# Altium project Sensors_IO_Board.PrjPcb
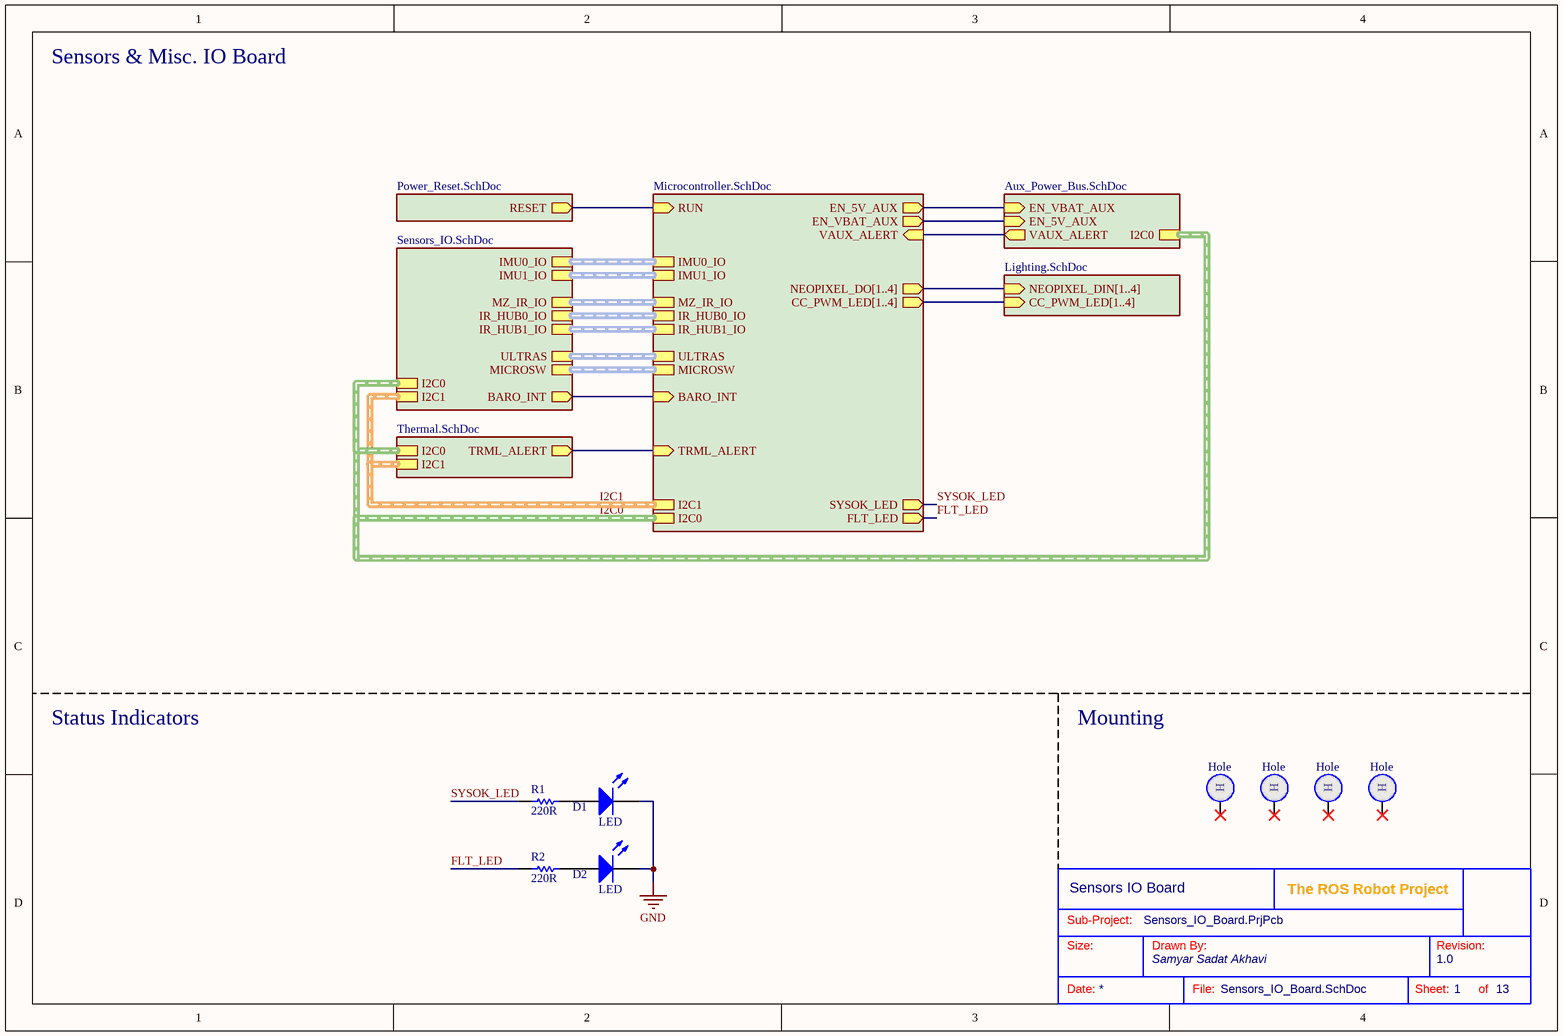
[diagram p0: Sensors_IO_Board.SchDoc]
MainProjectName: The ROS Robot Project
7 sheets, 136 parts. Net scope: hierarchical (ports join the sheet entries above them; power ports are global).
Board file: Sensors_IO_Board.PcbDoc
Sheets:
  Sensors_IO_Board.SchDoc
    MCU = Microcontroller.SchDoc
    THERM_CTRL = Thermal.SchDoc
      FAN1 = Fan_Drive.SchDoc
      FAN2 = Fan_Drive.SchDoc
      FAN3 = Fan_Drive.SchDoc
    LIGHTING = Lighting.SchDoc
      NEO_LED1 = Neopixel_Interface.SchDoc
      NEO_LED2 = Neopixel_Interface.SchDoc
      NEO_LED3 = Neopixel_Interface.SchDoc
      NEO_LED4 = Neopixel_Interface.SchDoc
  Ultrasonic_Interface.SchDoc

## Sheet Sensors_IO_Board.SchDoc: Sensors IO Board
size A4; DrawnBy: Samyar Sadat Akhavi; Revision: 1.0; SheetNumber: 1; SheetTotal: 13

### Parts
(Parts that share a designator on the sheet are numbered #1, #2 ... from top to bottom, then left to right.)
?#1  (no value)  (graphical)
D1  LED  [LED_1206]
D2  LED  [LED_1206]
Hole1  Hole  [hole_2.6]  (no BOM)
Hole2  Hole  [hole_2.6]  (no BOM)
Hole3  Hole  [hole_2.6]  (no BOM)
Hole4  Hole  [hole_2.6]  (no BOM)
R1  220R  [RES_0603]
R2  220R  [RES_0603]

### Sub-sheets
AUX_PWR = Aux_Power_Bus.SchDoc (file not in this document): I2C0 (harness I2C), EN_5V_AUX (in), VAUX_ALERT (out), EN_VBAT_AUX (in)
LIGHTING = Lighting.SchDoc: NEOPIXEL_DIN[1..4] (in), CC_PWM_LED[1..4] (in)
MCU = Microcontroller.SchDoc: RUN (in), I2C1 (harness I2C), I2C0 (harness I2C), EN_5V_AUX (out), EN_VBAT_AUX (out), VAUX_ALERT (in), BARO_INT (in), IR_HUB0_IO (harness ToF_Hub_IO), IR_HUB1_IO (harness ToF_Hub_IO), IMU0_IO (harness IMU_IO), IMU1_IO (harness IMU_IO), MICROSW (harness Microswitches), MZ_IR_IO (harness ToF_IO), ULTRAS (harness Ultrasonics), TRML_ALERT (in), NEOPIXEL_DO[1..4] (out), CC_PWM_LED[1..4] (out), FLT_LED (out), SYSOK_LED (out)
PWR = Power_Reset.SchDoc (file not in this document): RESET (out)
SENS_IO = Sensors_IO.SchDoc (file not in this document): BARO_INT (out), I2C0 (harness I2C), I2C1 (harness I2C), IMU0_IO (harness IMU_IO), IMU1_IO (harness IMU_IO), IR_HUB0_IO (harness ToF_Hub_IO), IR_HUB1_IO (harness ToF_Hub_IO), MICROSW (harness Microswitches), MZ_IR_IO (harness ToF_IO), ULTRAS (harness Ultrasonics)
THERM_CTRL = Thermal.SchDoc: I2C0 (harness I2C), I2C1 (harness I2C), TRML_ALERT (out)

### Nets
GND: D1.2(K) D2.2(K)
FLT_LED: R2.2 ; sheet MCU/FLT_LED
SYSOK_LED: R1.2 ; sheet MCU/SYSOK_LED
TRML_ALERT: sheet MCU/TRML_ALERT, sheet THERM_CTRL/TRML_ALERT
NetD1_1: D1.1(A) R1.1
NetD2_1: D2.1(A) R2.1
NetIC1_1: sheet MCU/EN_5V_AUX, sheet AUX_PWR/EN_VBAT_AUX
NetIC1_2: sheet MCU/EN_VBAT_AUX, sheet AUX_PWR/EN_5V_AUX
NetIC1_35: sheet MCU/RUN, sheet PWR/RESET
NetIC1_43: sheet MCU/BARO_INT, sheet SENS_IO/BARO_INT
NetIC1_57: sheet MCU/VAUX_ALERT, sheet AUX_PWR/VAUX_ALERT

Not connected (* = marked no-connect by the designer): Hole1 1*; Hole2 1*; Hole3 1*; Hole4 1*

### Buses and harness runs
bus sheet LIGHTING/CC_PWM_LED[1..4] = sheet MCU/CC_PWM_LED[1..4]
bus sheet LIGHTING/NEOPIXEL_DIN[1..4] = sheet MCU/NEOPIXEL_DO[1..4]
harness I2C0 = sheet AUX_PWR/I2C0 = sheet MCU/I2C0 = sheet SENS_IO/I2C0 = sheet THERM_CTRL/I2C0
harness I2C1 = sheet MCU/I2C1 = sheet SENS_IO/I2C1 = sheet THERM_CTRL/I2C1
harness sheet MCU/IMU0_IO = sheet SENS_IO/IMU0_IO
harness sheet MCU/IMU1_IO = sheet SENS_IO/IMU1_IO
harness sheet MCU/IR_HUB0_IO = sheet SENS_IO/IR_HUB0_IO
harness sheet MCU/IR_HUB1_IO = sheet SENS_IO/IR_HUB1_IO
harness sheet MCU/MICROSW = sheet SENS_IO/MICROSW
harness sheet MCU/MZ_IR_IO = sheet SENS_IO/MZ_IR_IO
harness sheet MCU/ULTRAS = sheet SENS_IO/ULTRAS

### Notes on the sheet
- Sensors & Misc. IO Board
- Status Indicators
- Mounting
- Sub-Project:
- Size:
- Drawn By:
- Revision:
- Date:
- File:
- Sheet:
- of
- (in symbol Hole) H

### Library data of the parts
?#1 = Standard Title Block
D1 = LED: Indicator LED; Color: Green
D2 = LED: Indicator LED; Color: Amber
R1 R2 = Resistor: Power: 1/8W; Value: 220R

## Sheet Microcontroller.SchDoc: Micrcontroller (RP2350B)
size B; DrawnBy: Samyar Sadat Akhavi; Revision: 1.0; SheetNumber: 3; SheetTotal: 13
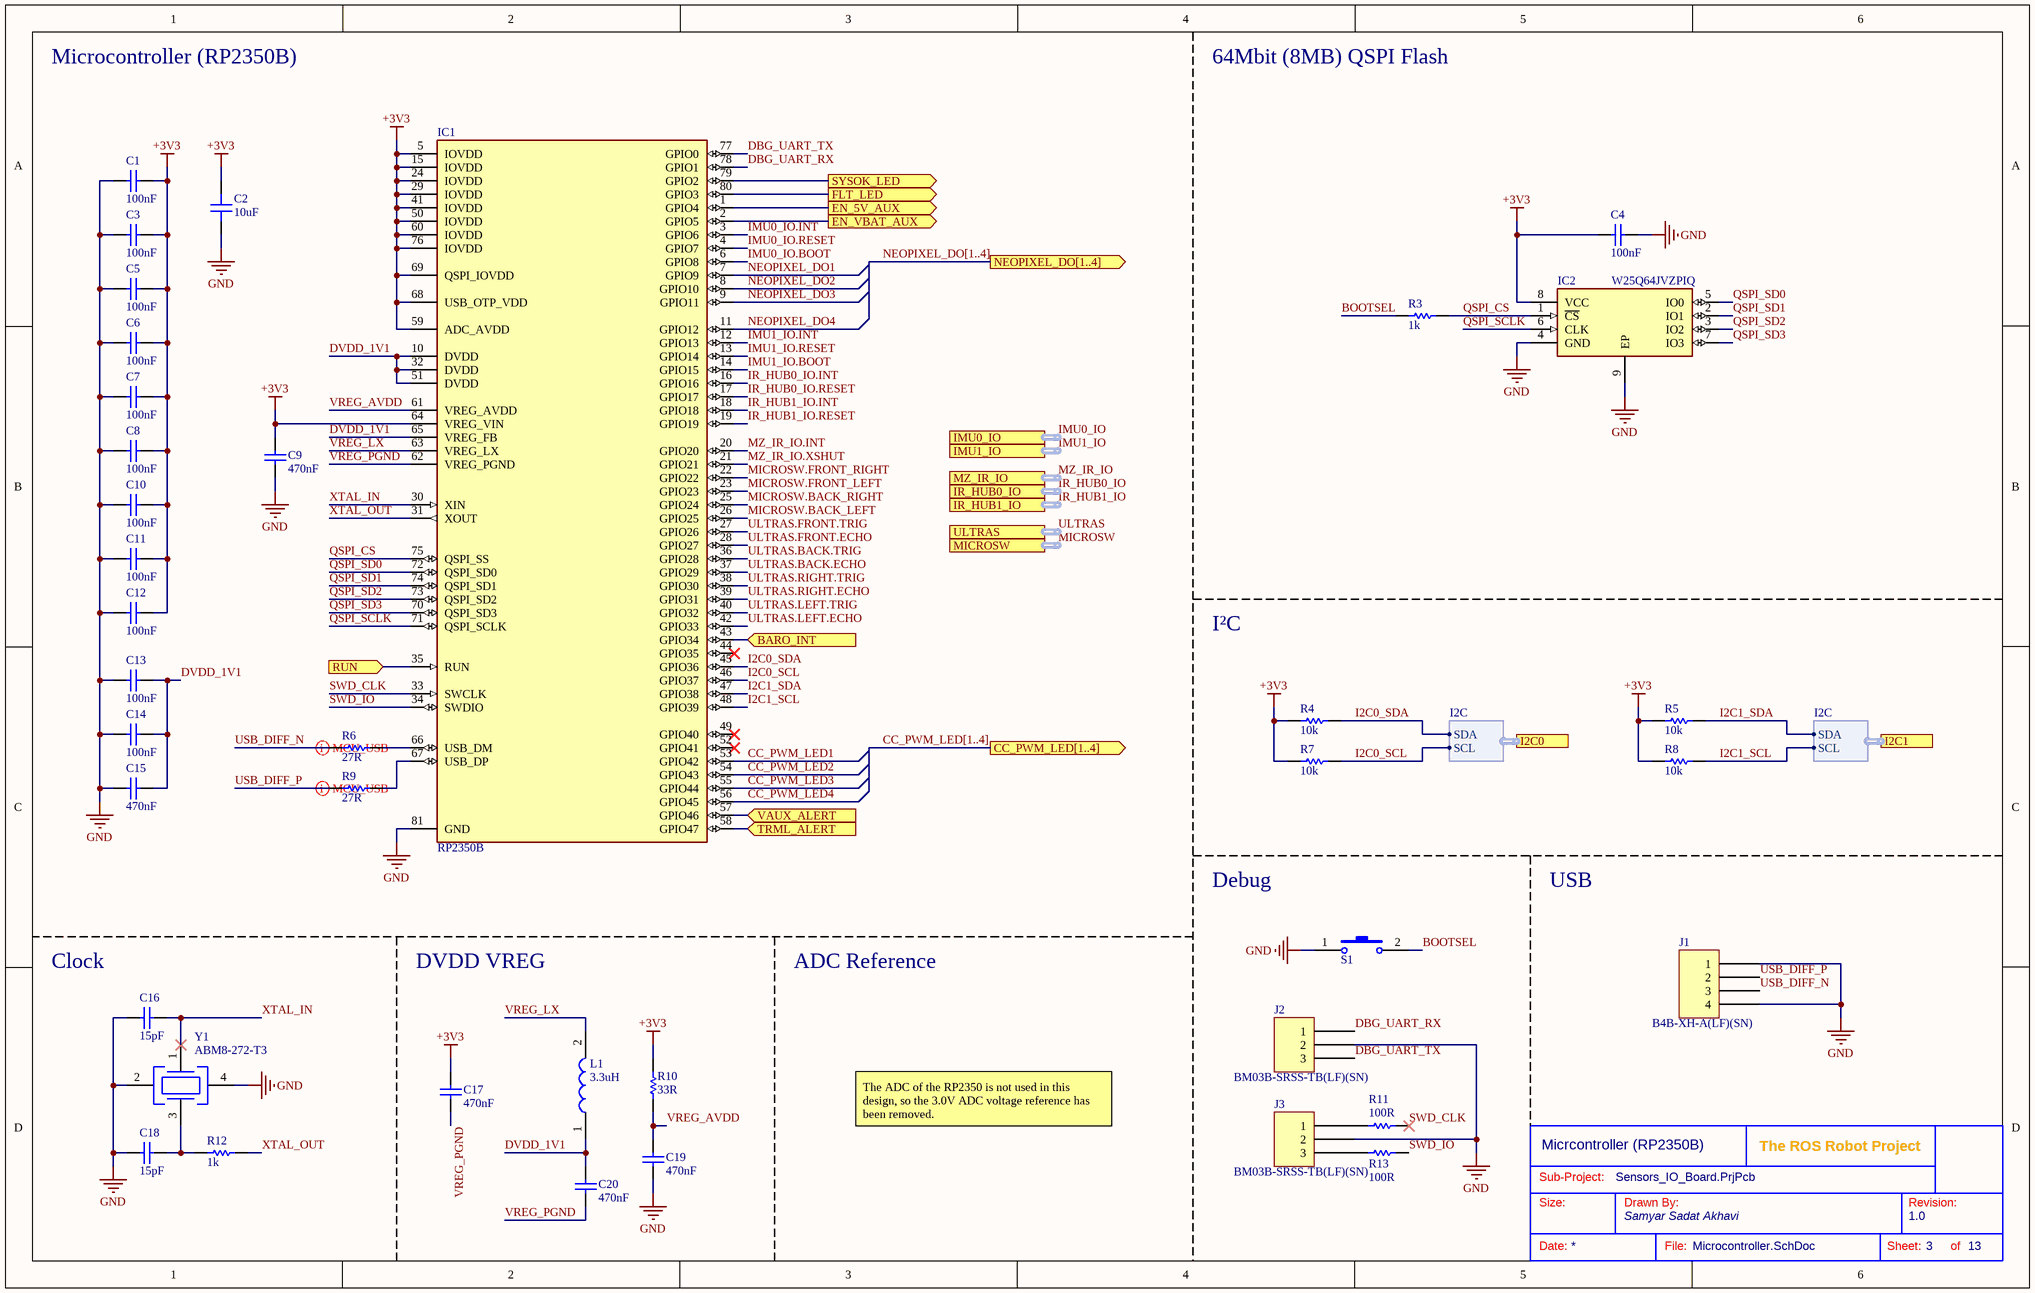
[diagram p1: Microcontroller.SchDoc]

### Parts
(Parts that share a designator on the sheet are numbered #1, #2 ... from top to bottom, then left to right.)
?#2  (no value)  (graphical)
C1  100nF  [CAP 0402_1005]
C2  10uF  [CAP 0805_2012]
C3  100nF  [CAP 0402_1005]
C4  100nF  [CAP_SMD_603]
C5  100nF  [CAP 0402_1005]
C6  100nF  [CAP 0402_1005]
C7  100nF  [CAP 0402_1005]
C8  100nF  [CAP 0402_1005]
C9  470nF  [CAP 0402_1005]
C10  100nF  [CAP 0402_1005]
C11  100nF  [CAP 0402_1005]
C12  100nF  [CAP 0402_1005]
C13  100nF  [CAP 0402_1005]
C14  100nF  [CAP 0402_1005]
C15  470nF  [CAP 0402_1005]
C16  15pF  [CAP 0402_1005]
C17  470nF  [CAP 0402_1005]
C18  15pF  [CAP 0402_1005]
C19  470nF  [CAP 0402_1005]
C20  470nF  [CAP 0402_1005]
IC1  RP2350B  [QFN40P1000X1000X90-81N-D]
IC2  W25Q64JVZPIQ  [SON127P600X500X80-9N-D]
J1  B4B-XH-A(LF)(SN)  [JST XH B4B-XH-A]
J2  BM03B-SRSS-TB(LF)(SN)  [JST BM03B-SRSS-TB]
J3  BM03B-SRSS-TB(LF)(SN)  [JST BM03B-SRSS-TB]
L1  3.3uH  [AOTAB201610S3R3101T]
R3  1k  [RES_0603]
R4  10k  [RES_0603]
R5  10k  [RES_0603]
R6  27R  [RES_0603]
R7  10k  [RES_0603]
R8  10k  [RES_0603]
R9  27R  [RES_0603]
R10  33R  [RES 0402_1005]
R11  100R  [RES_0603]
R12  1k  [RES 0402_1005]
R13  100R  [RES_0603]
S1  PTS815_SJK_250_SMTR_LFS  [PTS815SJK250SMTRLFS]  (value not drawn)
Y1  ABM8-272-T3  [ABM8272T3]

### Ports
BARO_INT (in, see Sensors_IO_Board[2B], Sensors_IO[1D]), CC_PWM_LED[1..4] (out, see Sensors_IO_Board[3B], Lighting[2A]), EN_5V_AUX (out, see Sensors_IO_Board[3A]), EN_VBAT_AUX (out, see Sensors_IO_Board[3A]), FLT_LED (out, see Sensors_IO_Board[3C]), I2C0 (harness I2C, see Sensors_IO_Board[2C], Aux_Power_Bus[4C], Sensors_IO[3C], Thermal[4C]), I2C1 (harness I2C, see Sensors_IO_Board[2B], Sensors_IO[3C], Thermal[4C]), IMU0_IO (harness IMU_IO, see Sensors_IO_Board[2B], Sensors_IO[4C]), IMU1_IO (harness IMU_IO, see Sensors_IO_Board[2B], Sensors_IO[3C]), IR_HUB0_IO (harness TOF_HUB_IO, see Sensors_IO_Board[2B], Sensors_IO[4B]), IR_HUB1_IO (harness ToF_Hub_IO, see Sensors_IO_Board[2B], Sensors_IO[3B]), MICROSW (harness Microswitches, see Sensors_IO_Board[2B], Sensors_IO[3C]), MZ_IR_IO (harness ToF_IO, see Sensors_IO_Board[2B], Sensors_IO[3C]), NEOPIXEL_DO[1..4] (out, see Sensors_IO_Board[3B]), RUN (in, see Sensors_IO_Board[2A]), SYSOK_LED (out, see Sensors_IO_Board[3B]), TRML_ALERT (in, see Sensors_IO_Board[2B], Thermal[4C]), ULTRAS (harness Ultrasonics, see Sensors_IO_Board[2B], Sensors_IO[3D]), VAUX_ALERT (in, see Sensors_IO_Board[3A], Aux_Power_Bus[4C])

### Harnesses
I2C: SDA, SCL

### Nets
+3V3: C1.1 C2.1 C3.1 C4.2 C5.1 C6.1 C7.1 C8.1 C9.2 C10.1 C11.1 C12.1 C17.1 IC1.5(IOVDD) IC1.15(IOVDD) IC1.24(IOVDD) IC1.29(IOVDD) IC1.41(IOVDD) IC1.50(IOVDD) IC1.59(ADC_AVDD) IC1.60(IOVDD) IC1.64(VREG_VIN) IC1.68(USB_OTP_VDD) IC1.69(QSPI_IOVDD) IC1.76(IOVDD) IC2.8(VCC) R4.2 R5.2 R7.2 R8.2 R10.1
GND: C1.2 C2.2 C3.2 C4.1 C5.2 C6.2 C7.2 C8.2 C9.1 C10.2 C11.2 C12.2 C13.1 C14.1 C15.1 C16.1 C18.1 C19.2 IC1.81(GND) IC2.4(GND) IC2.9(EP) J1.1 J1.4 J2.2 J3.2 S1.1(COM) Y1.2(GND_1) Y1.4(GND_2)
BOOTSEL: R3.2 S1.2(NO)
CC_PWM_LED1: IC1.53(GPIO42)
CC_PWM_LED2: IC1.54(GPIO43)
CC_PWM_LED3: IC1.55(GPIO44)
CC_PWM_LED4: IC1.56(GPIO45)
DBG_UART_RX: IC1.78(GPIO1) J2.1
DBG_UART_TX: IC1.77(GPIO0) J2.3
DVDD_1V1: C13.2 C14.2 C15.2 C20.1 IC1.10(DVDD) IC1.32(DVDD) IC1.51(DVDD) IC1.65(VREG_FB) L1.1
FLT_LED: IC1.80(GPIO3) ; port FLT_LED
I2C0_SCL: IC1.46(GPIO37) R7.1 ; port I2C0.SCL  [project net I2C0.SCL]
I2C0_SDA: IC1.45(GPIO36) R4.1 ; port I2C0.SDA  [project net I2C0.SDA]
I2C1_SCL: IC1.48(GPIO39) R8.1 ; port I2C1.SCL  [project net I2C1.SCL]
I2C1_SDA: IC1.47(GPIO38) R5.1 ; port I2C1.SDA  [project net I2C1.SDA]
IMU0_IO.BOOT: IC1.6(GPIO8)
IMU0_IO.INT: IC1.3(GPIO6)
IMU0_IO.RESET: IC1.4(GPIO7)
IMU1_IO.BOOT: IC1.14(GPIO15)
IMU1_IO.INT: IC1.12(GPIO13)
IMU1_IO.RESET: IC1.13(GPIO14)
IR_HUB0_IO.INT: IC1.16(GPIO16)
IR_HUB0_IO.RESET: IC1.17(GPIO17)
IR_HUB1_IO.INT: IC1.18(GPIO18)
IR_HUB1_IO.RESET: IC1.19(GPIO19)
MICROSW.BACK_LEFT: IC1.26(GPIO25)
MICROSW.BACK_RIGHT: IC1.25(GPIO24)
MICROSW.FRONT_LEFT: IC1.23(GPIO23)
MICROSW.FRONT_RIGHT: IC1.22(GPIO22)
MZ_IR_IO.INT: IC1.20(GPIO20)
MZ_IR_IO.XSHUT: IC1.21(GPIO21)
NEOPIXEL_DO1: IC1.7(GPIO9)  [project net NEOPIXEL_DIN1]
NEOPIXEL_DO2: IC1.8(GPIO10)  [project net NEOPIXEL_DIN2]
NEOPIXEL_DO3: IC1.9(GPIO11)  [project net NEOPIXEL_DIN3]
NEOPIXEL_DO4: IC1.11(GPIO12)  [project net NEOPIXEL_DIN4]
QSPI_CS: IC1.75(QSPI_SS) IC2.1(~{CS}) R3.1
QSPI_SCLK: IC1.71(QSPI_SCLK) IC2.6(CLK)
QSPI_SD0: IC1.72(QSPI_SD0) IC2.5(IO0)
QSPI_SD1: IC1.74(QSPI_SD1) IC2.2(IO1)
QSPI_SD2: IC1.73(QSPI_SD2) IC2.3(IO2)
QSPI_SD3: IC1.70(QSPI_SD3) IC2.7(IO3)
SWD_CLK: IC1.33(SWCLK) R11.1
SWD_IO: IC1.34(SWDIO) R13.1
SYSOK_LED: IC1.79(GPIO2) ; port SYSOK_LED
TRML_ALERT: IC1.58(GPIO47) ; port TRML_ALERT
ULTRAS.BACK.ECHO: IC1.37(GPIO29)
ULTRAS.BACK.TRIG: IC1.36(GPIO28)
ULTRAS.FRONT.ECHO: IC1.28(GPIO27)
ULTRAS.FRONT.TRIG: IC1.27(GPIO26)
ULTRAS.LEFT.ECHO: IC1.42(GPIO33)
ULTRAS.LEFT.TRIG: IC1.40(GPIO32)
ULTRAS.RIGHT.ECHO: IC1.39(GPIO31)
ULTRAS.RIGHT.TRIG: IC1.38(GPIO30)
USB_DIFF_N: J1.3 R6.1
USB_DIFF_P: J1.2 R9.1
VREG_AVDD: C19.1 IC1.61(VREG_AVDD) R10.2
VREG_LX: IC1.63(VREG_LX) L1.2
VREG_PGND: C17.2 C20.2 IC1.62(VREG_PGND)
XTAL_IN: C16.2 IC1.30(XIN) Y1.1(CRYSTAL_1)
XTAL_OUT: IC1.31(XOUT) R12.2
NetC18_2: C18.2 R12.1 Y1.3(CRYSTAL_2)
NetIC1_1: IC1.1(GPIO4) ; port EN_5V_AUX
NetIC1_2: IC1.2(GPIO5) ; port EN_VBAT_AUX
NetIC1_35: IC1.35(RUN) ; port RUN
NetIC1_43: IC1.43(GPIO34) ; port BARO_INT
NetIC1_57: IC1.57(GPIO46) ; port VAUX_ALERT
NetIC1_66: IC1.66(USB_DM) R6.2
NetIC1_67: IC1.67(USB_DP) R9.2
NetJ3_1: J3.1 R11.2
NetJ3_3: J3.3 R13.2

Not connected (* = marked no-connect by the designer): IC1 44(GPIO35)* 49(GPIO40)* 52(GPIO41)*

### Buses and harness runs
bus CC_PWM_LED[1..4] = port CC_PWM_LED[1..4]
bus NEOPIXEL_DO[1..4] = port NEOPIXEL_DO[1..4]
harness IMU0_IO = port IMU0_IO
harness IMU1_IO = port IMU1_IO
harness IR_HUB0_IO = port IR_HUB0_IO
harness IR_HUB1_IO = port IR_HUB1_IO
harness MICROSW = port MICROSW
harness MZ_IR_IO = port MZ_IR_IO
harness ULTRAS = port ULTRAS

### Layout directives
differential pair: USB_DIFF_N, USB_DIFF_P

### Notes on the sheet
- Microcontroller (RP2350B)
- 64Mbit (8MB) QSPI Flash
- I²C
- Debug
- USB
- Clock
- DVDD VREG
- ADC Reference
- The ADC of the RP2350 is not used in this design, so the 3.0V ADC voltage reference has been removed.
- Sub-Project:
- Size:
- Drawn By:
- Revision:
- Date:
- File:
- Sheet:
- of

### Library data of the parts
?#2 = Standard Title Block
C1 C3-C20 = Non-polar Capacitor: Generic Ceramic Capacitor; Voltage: 6.3V
  C1 C3-C8 C10-C14: Value: 100nF
  C9 C15 C17 C19 C20: Value: 470nF
  C16 C18: Value: 15pF
C2 = CL21A106KOQNNNE: CAP CER 10UF 16V X5R 0805; manufacturer: Samsung Electro-Mechanics; Capacitance: 10 µF; Tolerance: ±10%; Part Number: CL21A106KOQNNNE; Applications: General Purpose; componentlink1description: Datasheet; componentlink1url: http://www.samsungsem.com/kr/support/product-search/mlcc/CL21A106KOQNNNE.jsp; componentlink2description: DigiKey Link; componentlink2url: https://www.digikey.com/en/products/detail/samsung-electro-mechanics/CL21A106KOQNNNE/3886754; Device Package: 0805 (2012 Metric); lastupdated: 2/9/2024 8:15:37 PM; Lifecycle Status: Active; Minimum Order: 1; Mounting Type: Surface Mount, MLCC; Operating Temperature: -55°C ~ 85°C; Package / Case: 0805 (2012 Metric); packaging: TapeAndReel; partid: 14297; Part Status: Active; price: 0.01; series: CL; Size / Dimension: 0.079" L x 0.049" W (2.00mm x 1.25mm); Supplier 1: DigiKey; Supplier Part Number 1: 1276-1096-1-ND; Temperature Coefficient: X5R; Thickness (Max): 0.055" (1.40mm); value: 10uF; Voltage - Rated: 16V
IC1 = RP2350B: Integrated Circuit; Manufacturer_Name: RASPBERRY-PI; Datasheet Link: https://datasheets.raspberrypi.com/rp2350/rp2350-product-brief.pdf; Height: 0.9mm; Manufacturer_Part_Number: RP2350B
IC2 = W25Q64JVZPIQ: Integrated Circuit; Manufacturer_Name: Winbond; Datasheet Link: https://www.winbond.com/hq/search-resource-file.jsp?partNo=W25Q64JVZPIQ&type=datasheet; Height: 0.8mm; Manufacturer_Part_Number: W25Q64JVZPIQ; Mouser Part Number: 454-W25Q64JVZPIQ; Mouser Price/Stock: https://www.mouser.co.uk/ProductDetail/Winbond/W25Q64JVZPIQ?qs=qSfuJ%252Bfl%2Fd7Nj8XAKQ%2FzKA%3D%3D; Arrow Part Number: W25Q64JVZPIQ; Arrow Price/Stock: https://www.arrow.com/en/products/w25q64jvzpiq/winbond-electronics?utm_currency=USD&region=nac
J1 = B4B-XH-A(LF)(SN): CONN HEADER VERT 4POS 2.5MM; Manufacturer: JST Sales America Inc.; Contact Length - Post: 0.134" (3.40mm); Current Rating (Amps): 3A; Material Flammability Rating: UL94 V-0; Number of Positions: 4; Number of Positions Loaded: All; Pitch - Mating: 0.098" (2.50mm); Shrouding: Shrouded - 4 Wall; Style: Board to Cable/Wire; Voltage Rating: 250V; System: Connector; Part Number: B4B-XH-A(LF)(SN); ComponentLink1Description: Datasheet; ComponentLink1URL: http://www.jst-mfg.com/product/pdf/eng/eXH.pdf; ComponentLink2Description: DigiKey Link; ComponentLink2URL: http://digikey.com/product-detail/en/jst-sales-america-inc/B4B-XH-A-LF-SN/455-2249-ND/1651047; Connector Type: Header; Contact Finish - Mating: Tin; Contact Finish - Post: Tin; Contact Material: Brass; Contact Shape: Square; Contact Type: Male Pin; Fastening Type: Detent Lock; Insulation Color: Natural; Insulation Height: 0.276" (7.00mm); Insulation Material: Polyamide (PA66), Nylon 6/6; LastUpdated: 1/12/2020 11:46:34 PM; Lifecycle Status: Active; Minimum Order: 1; Mounting Type: Through Hole; Number of Rows: 1; Operating Temperature: -25°C ~ 85°C; Packaging: Bulk; PartId: 69; Part Status: Active; Price: 0.21; Series: XH; Supplier 1: DigiKey; Supplier Part Number 1: 455-2249-ND; Termination: Press-Fit, Solder
J2 J3 = BM03B-SRSS-TB(LF)(SN): CONN HEADER SMD 3POS 1MM; Manufacturer: JST Sales America Inc.; Current Rating (Amps): 0.7A; Material Flammability Rating: UL94 V-0; Number of Positions: 3; Number of Positions Loaded: All; Pitch - Mating: 0.039" (1.00mm); Shrouding: Shrouded - 4 Wall; Style: Board to Cable/Wire; Voltage Rating: 50V; Part Number: BM03B-SRSS-TB(LF)(SN); ComponentLink1Description: Datasheet; ComponentLink1URL: http://www.jst-mfg.com/product/pdf/eng/eSR.pdf; ComponentLink2Description: DigiKey Link; ComponentLink2URL: http://digikey.com/product-detail/en/jst-sales-america-inc/BM03B-SRSS-TB-LF-SN/455-1789-1-ND/926860; Connector Type: Header; Contact Finish - Mating: Tin; Contact Finish - Post: Tin; Contact Material: Copper Alloy; Contact Shape: Square; Contact Type: Male Pin; Fastening Type: Push-Pull; Features: Solder Retention; Insulation Color: Natural; Insulation Height: 0.167" (4.25mm); Insulation Material: Polyamide (PA), Nylon; LastUpdated: 1/12/2020 10:12:14 PM; Lifecycle Status: Active; Minimum Order: 1; Mounting Type: Surface Mount; Number of Rows: 1; Operating Temperature: -25°C ~ 85°C; Packaging: TapeAndReel; PartId: 14; Part Status: Active; Price: 0.24; Series: SR; Supplier 1: DigiKey; Supplier Part Number 1: 455-1789-1-ND; Termination: Solder
L1 = AOTA-B201610S3R3-101-T: Inductor; Manufacturer_Name: ABRACON; Datasheet Link: https://abracon.com/datasheets/AOTA-B201610S3R3-101-T.pdf; Height: 1mm; Manufacturer_Part_Number: AOTA-B201610S3R3-101-T; Mouser Part Number: 815-AB201610S3R3101T; Mouser Price/Stock: https://www.mouser.co.uk/ProductDetail/ABRACON/AOTA-B201610S3R3-101-T?qs=%252BXxaIXUDbq0IZvJW%2F2mv4w%3D%3D; Arrow Part Number: AOTA-B201610S3R3-101-T; Arrow Price/Stock: https://www.arrow.com/en/products/aota-b201610s3r3-101-t/abracon?utm_currency=USD&region=nac
R3-R5 R7 R8 R11 R13 = Resistor: Power: 1/8W
  R3: Value: 1k
  R4 R5 R7 R8: Value: 10k
  R11 R13: Value: 100R
R6 R9 R10 R12 = Resistor: Generic Resistor; Power: 1/8W
  R6 R9: Value: 27R
  R10: Value: 33R
  R12: Value: 1k
S1 = PTS815_SJK_250_SMTR_LFS: Switch; Manufacturer_Name: C & K COMPONENTS; Manufacturer_Part_Number: PTS815 SJK 250 SMTR LFS; Datasheet Link: https://www.mouser.com/datasheet/2/60/pts815-1535658.pdf; Height: 2mm; Mouser Part Number: 611-PTS815SJK250SMTR; Mouser Price/Stock: https://www.mouser.co.uk/ProductDetail/CK/PTS815-SJK-250-SMTR-LFS?qs=ahcBuItHZ3yETpGYMHf%2FgQ%3D%3D; Arrow Part Number: PTS815 SJK 250 SMTR LFS; Arrow Price/Stock: https://www.arrow.com/en/products/pts815-sjk-250-smtr-lfs/ck
Y1 = ABM8-272-T3: Crystal or Oscillator; Manufacturer_Name: ABRACON; Datasheet Link: https://abracon.com/datasheets/ABM8-272-T3.pdf; Height: 0.8mm; Manufacturer_Part_Number: ABM8-272-T3; Mouser Part Number: 815-ABM8-272-T3; Mouser Price/Stock: https://www.mouser.co.uk/ProductDetail/ABRACON/ABM8-272-T3?qs=QpmGXVUTftEj6miOiJBMxQ%3D%3D

## Sheet Thermal.SchDoc: Thermal Management
size A4; DrawnBy: Samyar Sadat Akhavi; Revision: 1.0; SheetNumber: 8; SheetTotal: 13
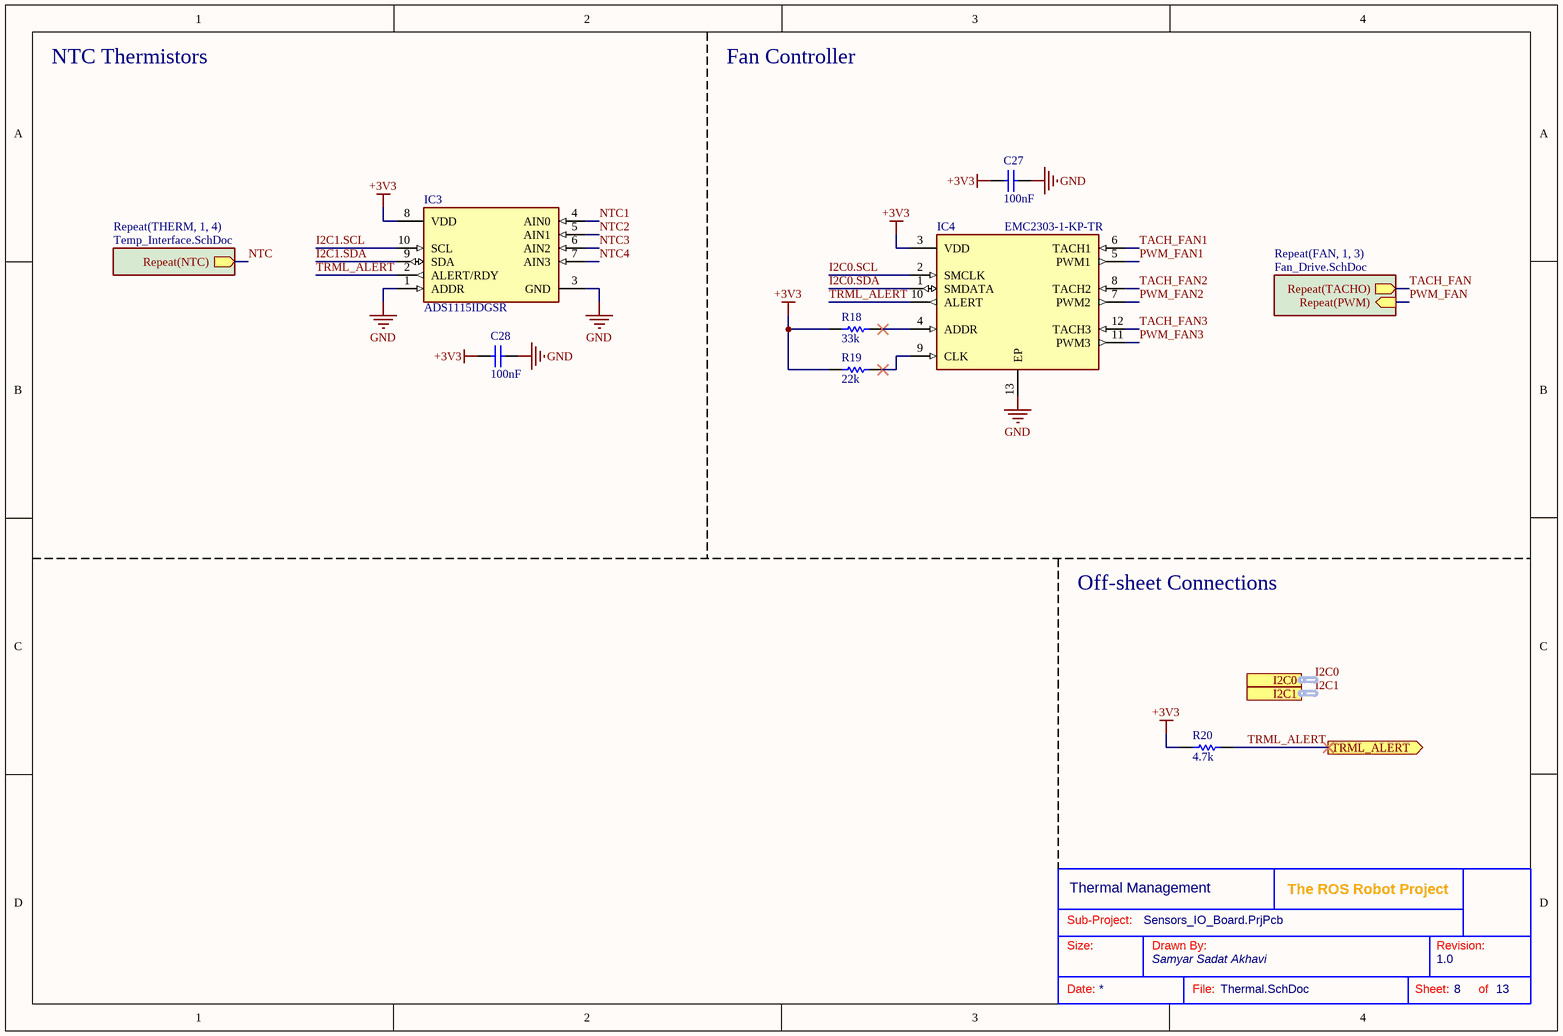
[diagram p2: Thermal.SchDoc]

### Parts
(Parts that share a designator on the sheet are numbered #1, #2 ... from top to bottom, then left to right.)
?#3  (no value)  (graphical)
C27  100nF  [CAP_SMD_603]
C28  100nF  [CAP_SMD_603]
IC3  ADS1115IDGSR  [SOP50P490X110-10N]
IC4  EMC2303-1-KP-TR  [QFN80P400X400X90-13N-D]
R18  33k  [RES_0603]
R19  22k  [RES_0603]
R20  4.7k  [RES_0603]

### Sub-sheets
Repeat(FAN, 1, 3) = Fan_Drive.SchDoc: Repeat(TACHO) (out), Repeat(PWM) (in)
Repeat(THERM, 1, 4) = Temp_Interface.SchDoc (file not in this document): Repeat(NTC) (out)

### Ports
I2C0 (harness I2C, see Sensors_IO_Board[2B], Aux_Power_Bus[4C], Microcontroller[5C], Sensors_IO[3C]), I2C1 (harness I2C, see Sensors_IO_Board[2B], Microcontroller[6C], Sensors_IO[3C]), TRML_ALERT (out, see Sensors_IO_Board[2B], Microcontroller[3C])

### Nets
+3V3: C27.2 C28.2 IC3.8(VDD) IC4.3(VDD) R18.2 R19.2 R20.1
GND: C27.1 C28.1 IC3.1(ADDR) IC3.3(GND) IC4.13(EP)
I2C0.SCL: IC4.2(SMCLK)
I2C0.SDA: IC4.1(SMDATA)
I2C1.SCL: IC3.10(SCL)
I2C1.SDA: IC3.9(SDA)
NTC: sheet Repeat(THERM, 1, 4)/Repeat(NTC)
NTC1: IC3.4(AIN0)
NTC2: IC3.5(AIN1)
NTC3: IC3.6(AIN2)
NTC4: IC3.7(AIN3)
PWM_FAN: sheet Repeat(FAN, 1, 3)/Repeat(PWM)
PWM_FAN1: IC4.5(PWM1)
PWM_FAN2: IC4.7(PWM2)
PWM_FAN3: IC4.11(PWM3)
TACH_FAN: sheet Repeat(FAN, 1, 3)/Repeat(TACHO)
TACH_FAN1: IC4.6(TACH1)
TACH_FAN2: IC4.8(TACH2)
TACH_FAN3: IC4.12(TACH3)
TRML_ALERT: IC3.2(ALERT/RDY) IC4.10(ALERT) R20.2 ; port TRML_ALERT
NetIC4_4: IC4.4(ADDR) R18.1
NetIC4_9: IC4.9(CLK) R19.1

### Buses and harness runs
harness I2C0 = port I2C0
harness I2C1 = port I2C1

### Notes on the sheet
- NTC Thermistors
- Fan Controller
- Off-sheet Connections
- Sub-Project:
- Size:
- Drawn By:
- Revision:
- Date:
- File:
- Sheet:
- of

### Library data of the parts
?#3 = Standard Title Block
C27 C28 = Non-polar Capacitor: Generic Ceramic Capacitor; Voltage: 6.3V; Value: 100nF
IC3 = ADS1115IDGSR: Integrated Circuit; Manufacturer_Name: Texas Instruments; Datasheet Link: http://www.ti.com/lit/gpn/ADS1115; Height: 1.1mm; Manufacturer_Part_Number: ADS1115IDGSR; Mouser Part Number: 595-ADS1115IDGSR; Mouser Price/Stock: https://www.mouser.co.uk/ProductDetail/Texas-Instruments/ADS1115IDGSR?qs=IK5e5L0zOXjKCJoVMhYO%2FQ%3D%3D; Arrow Part Number: ADS1115IDGSR; Arrow Price/Stock: https://www.arrow.com/en/products/ads1115idgsr/texas-instruments?utm_currency=USD&region=nac
IC4 = EMC2303-1-KP-TR: Integrated Circuit; Manufacturer_Name: Microchip; Datasheet Link: https://componentsearchengine.com/Datasheets/1/EMC2303-1-KP-TR.pdf; Height: 0.9mm; Manufacturer_Part_Number: EMC2303-1-KP-TR; Mouser Part Number: 886-EMC2303-1-KP-TR; Mouser Price/Stock: https://www.mouser.co.uk/ProductDetail/Microchip-Technology/EMC2303-1-KP-TR?qs=pA5MXup5wxGoL5M5tUOQYw%3D%3D; Arrow Part Number: EMC2303-1-KP-TR; Arrow Price/Stock: https://www.arrow.com/en/products/emc2303-1-kp-tr/microchip-technology?utm_currency=USD&region=nac
R18-R20 = Resistor: Power: 1/8W
  R18: Value: 33k
  R19: Value: 22k
  R20: Value: 4.7k

## Sheet Fan_Drive.SchDoc: Fan Drive Circuitry
size A4; DrawnBy: Samyar Sadat Akhavi; Revision: 1.0; SheetNumber: 10; SheetTotal: 14
Used 3 times, as channels THERM_CTRL/FAN1, THERM_CTRL/FAN2, THERM_CTRL/FAN3. Parts and nets are listed once, with the designators drawn on the sheet.
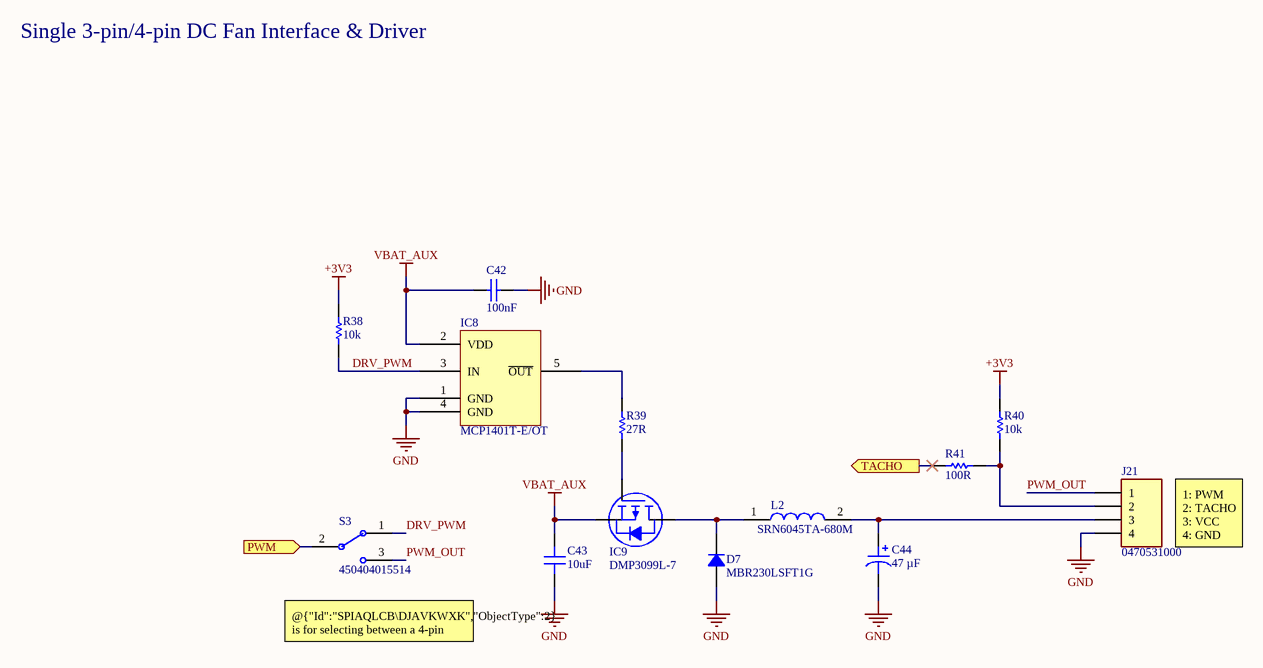
[diagram p3: Fan_Drive.SchDoc]

### Parts
?  (no value)  (graphical)
C42  100nF  [CAP_SMD_603]
C43  10uF  [CAP 0805_2012]
C44  47 µF  [CAP ALSMD 6.6MM H5.4MM]
D7  MBR230LSFT1G  [SOD123F]
IC8  MCP1401T-E/OT  [MICROCHIP SOT-23-5 OT]
IC9  DMP3099L-7  [DIODES SOT-23-3]
J21  0470531000  [0470531000]
L2  SRN6045TA-680M  [SRN6045TA]
R38  10k  [RES_0603]
R39  27R  [RES_0603]
R40  10k  [RES_0603]
R41  100R  [RES_0603]
S3  450404015514  [WURTH WS-SLSU 450404015514]

### Ports
PWM (in, see Thermal[4B]), TACHO (out, see Thermal[4B])

### Nets
+3V3: R38.2 R40.1
GND: C42.2 C43.1 C44.2 D7.1 IC8.1(GND) IC8.4(GND) J21.4
VBAT_AUX: C42.1 C43.2 IC8.2(VDD) IC9.2(S)
DRV_PWM: IC8.3(IN) R38.1 S3.1
PWM: S3.2(COM) ; port PWM
PWM_OUT: J21.1 S3.3
TACHO: R41.1 ; port TACHO
NetC44_1: C44.1 J21.3 L2.2
NetD7_2: D7.2 IC9.3(D) L2.1
NetIC8_5: IC8.5(~{OUT}) R39.1
NetIC9_1: IC9.1(G) R39.2
NetJ21_2: J21.2 R40.2 R41.2

### Channels
THERM_CTRL/FAN1: designators end in _FAN1; ports PWM=PWM_FAN1 TACHO=TACH_FAN1
THERM_CTRL/FAN2: designators end in _FAN2; ports PWM=PWM_FAN2 TACHO=TACH_FAN2
THERM_CTRL/FAN3: designators end in _FAN3; ports PWM=PWM_FAN3 TACHO=TACH_FAN3

### Notes on the sheet
- Single 3-pin/4-pin DC Fan Interface & Driver
- 1: PWM
  2: TACHO
  3: VCC
  4: GND
- (near S3) @{"Id":"SPIAQLCB\DJAVKWXK","ObjectType":2} is for selecting between a 4-pin PWM fan or a 3-pin DC fan.
- Sub-Project:
- Size:
- Drawn By:
- Revision:
- Date:
- File:
- Sheet:
- of

### Library data of the parts
? = Standard Title Block
C42 = Non-polar Capacitor: Generic Ceramic Capacitor; Voltage: 6.3V; Value: 100nF
C43 = CL21A106KOQNNNE: as C2 on sheet Microcontroller; Part Number: CL21A106KOQNNNE; Applications: General Purpose; componentlink1description: Datasheet; componentlink1url: http://www.samsungsem.com/kr/support/product-search/mlcc/CL21A106KOQNNNE.jsp; componentlink2description: DigiKey Link; componentlink2url: https://www.digikey.com/en/products/detail/samsung-electro-mechanics/CL21A106KOQNNNE/3886754; Device Package: 0805 (2012 Metric); lastupdated: 2/9/2024 8:15:37 PM; Lifecycle Status: Active; Minimum Order: 1; Mounting Type: Surface Mount, MLCC; Operating Temperature: -55°C ~ 85°C; Package / Case: 0805 (2012 Metric); packaging: TapeAndReel; partid: 14297; Part Status: Active; price: 0.01; series: CL; Size / Dimension: 0.079" L x 0.049" W (2.00mm x 1.25mm); Supplier 1: DigiKey; Supplier Part Number 1: 1276-1096-1-ND; Temperature Coefficient: X5R; Thickness (Max): 0.055" (1.40mm); value: 10uF; Voltage - Rated: 16V
C44 = 865080443007: CAP ALUM 47UF 20% 25V SMD; manufacturer: Würth Elektronik; Impedance: 560 mOhms; Lifetime @ Temp.: 2000 Hrs @ 105°C; Polarization: Polar; Ripple Current @ High Frequency: 220 mA @ 100 kHz; Ripple Current @ Low Frequency: 143 mA @ 120 Hz; Surface Mount Land Size: 0.260" L x 0.260" W (6.60mm x 6.60mm); Part Number: 865080443007; Applications: General Purpose; Capacitance: 47 µF; componentlink1description: Datasheet; componentlink1url: https://katalog.we-online.de/pbs/datasheet/865080443007.pdf; componentlink2description: DigiKey Link; componentlink2url: https://www.digikey.com/en/products/detail/würth-elektronik/865080443007/5728030; Device Package: Radial, Can - SMD; Height - Seated (Max): 0.217" (5.50mm); lastupdated: 6/3/2024 7:53:40 PM; Lifecycle Status: Active; Minimum Order: 1; Mounting Type: Surface Mount; Operating Temperature: -55°C ~ 105°C; Package / Case: Radial, Can - SMD; packaging: TapeAndReel; partid: 8980; Part Status: Active; price: 0.15; series: WCAP-ASLI; Size / Dimension: 0.248" Dia (6.30mm); Supplier 1: DigiKey; Supplier Part Number 1: 732-8435-1-ND; Tolerance: ±20%; value: 47 µF; Voltage - Rated: 25 V
D7 = MBR230LSFT1G: DIODE SCHOTTKY 30V 2A SOD123L; Manufacturer: ON Semiconductor; Current - Reverse Leakage @ Vr: 1mA @ 30V; Speed: Fast Recovery =< 500ns, > 200mA (Io); Voltage - Forward (Vf) (Max) @ If: 430mV @ 2A; Part Number: MBR230LSFT1G; ComponentLink1Description: Datasheet; ComponentLink1URL: http://www.onsemi.com/pub/Collateral/MBR230LSFT1-D.PDF; ComponentLink2Description: DigiKey Link; ComponentLink2URL: http://digikey.com/product-detail/en/on-semiconductor/MBR230LSFT1G/MBR230LSFT1GOSCT-ND/1967064; Current - Average Rectified (Io): 2A; Diode Type: Schottky; LastUpdated: 6/3/2024 7:54:57 PM; Lifecycle Status: Active; Minimum Order: 1; Mounting Type: Surface Mount; Operating Temperature - Junction: -55°C ~ 125°C; Package / Case: SOD-123F; Packaging: TapeAndReel; PartId: 2381; Part Status: Active; Price: 0.08; Series: -; Supplier 1: DigiKey; Supplier Part Number 1: MBR230LSFT1GOSCT-ND; Supplier Device Package: SOD-123L; Voltage - DC Reverse (Vr) (Max): 30V
IC8 = MCP1401T-E/OT: IC GATE DRVR LOW-SIDE SOT23-5; Manufacturer: Microchip Technology; Channel Type: Single; Current - Peak Output (Source, Sink): 500mA, 500mA; Gate Type: IGBT, N-Channel, P-Channel MOSFET; Input Type: Inverting; Logic Voltage - VIL, VIH: 0.8V, 2.4V; Number of Drivers: 1; Rise / Fall Time (Typ): 19ns, 15ns; Voltage - Supply: 4.5V ~ 18V; Part Number: MCP1401T-E/OT; ComponentLink1Description: Datasheet; ComponentLink1URL: http://www.microchip.com/mymicrochip/filehandler.aspx?ddocname=en530890; ComponentLink2Description: DigiKey Link; ComponentLink2URL: http://digikey.com/product-detail/en/microchip-technology/MCP1401T-E-OT/MCP1401T-E-OTCT-ND/1956553; Device Package: SC-74A, SOT-753; Driven Configuration: Low-Side; LastUpdated: 1/31/2020 1:34:08 AM; Lifecycle Status: Active; Minimum Order: 1; Mounting Type: Surface Mount; Operating Temperature: -40°C ~ 125°C; Package / Case: SC-74A, SOT-753; Packaging: TapeAndReel; PartId: 9; Part Status: Active; Price: 0.47; Series: -; Supplier 1: DigiKey; Supplier Part Number 1: MCP1401T-E/OTCT-ND; Supplier Device Package: SOT-23-5
IC9 = DMP3099L-7: MOSFET P-CH 30V 3.8A SOT23; Manufacturer: Diodes Incorporated; Current - Continuous Drain (Id) @ 25°C: 3.8A (Ta); Drive Voltage (Max Rds On,  Min Rds On): 4.5V, 10V; FET Type: P-Channel; Gate Charge (Qg) (Max) @ Vgs: 5.2 nC @ 4.5 V; Input Capacitance (Ciss) (Max) @ Vds: 563 pF @ 25 V; Power Dissipation (Max): 1.08W (Ta); Rds On (Max) @ Id, Vgs: 65mOhm @ 3.8A, 10V; Vgs (Max): ±20V; Vgs(th) (Max) @ Id: 2.1V @ 250µA; Part Number: DMP3099L-7; ComponentLink1Description: Datasheet; ComponentLink1URL: https://www.diodes.com/assets/Datasheets/DMP3099L.pdf; ComponentLink2Description: DigiKey Link; ComponentLink2URL: https://www.digikey.com/en/products/detail/diodes-incorporated/DMP3099L-7/4471075; Drain to Source Voltage (Vdss): 30 V; LastUpdated: 6/3/2024 8:15:20 PM; Lifecycle Status: Active; Minimum Order: 1; Mounting Type: Surface Mount; Operating Temperature: -55°C ~ 150°C (TJ); Package / Case: TO-236-3, SC-59, SOT-23-3; Packaging: TapeAndReel; Part Status: Active; Price: 0.04; Series: -; Supplier 1: DigiKey; Supplier Part Number 1: DMP3099L-7DICT-ND; Supplier Device Package: SOT-23-3; Technology: MOSFET (Metal Oxide)
J21 = 0470531000: Connector; Manufacturer_Name: Molex; Datasheet Link: https://www.molex.com/en-us/products/part-detail-pdf/470531000?display=pdf; Manufacturer_Part_Number: 0470531000; Mouser Part Number: N/A; Mouser Price/Stock: https://www.mouser.co.uk/ProductDetail/Molex/0470531000?qs=PBcRNPEHKsr8N9RyuOy6rw%3D%3D; Arrow Part Number: 0470531000; Arrow Price/Stock: https://www.arrow.com/en/products/0470531000/molex?utm_currency=USD&region=nac
L2 = SRN6045TA-680M: Inductor; Manufacturer_Name: Bourns; Datasheet Link: http://www.bourns.com/docs/Product-Datasheets/SRN6045TA.pdf; Manufacturer_Part_Number: SRN6045TA-680M; Mouser Part Number: 652-SRN6045TA-680M; Mouser Price/Stock: https://www.mouser.co.uk/ProductDetail/Bourns/SRN6045TA-680M?qs=Vt59ZOdFuWZwwb5da9XlfA%3D%3D; Arrow Part Number: SRN6045TA-680M; Arrow Price/Stock: https://www.arrow.com/en/products/srn6045ta-680m/bourns?utm_currency=USD&region=nac
R38-R41 = Resistor: Power: 1/8W
  R38 R40: Value: 10k
  R39: Value: 27R
  R41: Value: 100R
S3 = 450404015514: MINI SLIDE SWITCH 6.7 X 2.7 MM.; Manufacturer: Würth Elektronik; Rated Current: 300mA; Rated Voltage: 5VDC; Switching Function: On-On; Circuit: SPDT; Actuator Length: 1.50mm; Actuator Type: Standard; Contact Timing: Non-Shorting (BBM); Current Rating (Amps): 300mA (DC); Voltage Rating - DC: 5 V; ComponentLink1Description: Datasheet; ComponentLink1URL: https://katalog.we-online.de/em/datasheet/450404015514.pdf; ComponentLink2Description: DigiKey Link; ComponentLink2URL: https://www.digikey.com/en/products/detail/würth-elektronik/450404015514/9950812; Packaging: TapeAndReel; Publisher: Wurth Elektronik; Contact Material: Copper Alloy; Mounting Technology: SMT; Operating Temperature: -40°C ~ 85°C; Contact Plating: Silver; Part Number: 450404015514; Published Date: September 2019; Terminal Material: Copper Alloy; Size: 6.7x2.7mm; Terminal Plating: Silver; Contact Finish: Silver; LastUpdated: 6/20/2022 1:21:56 PM; Lifecycle Status: Active; Minimum Order: 1; Mounting Type: Surface Mount; PartId: 5; Part Status: Active; Price: 0.48; Series: WS-SLSU; Supplier 1: DigiKey; Supplier Part Number 1: 732-13665-1-ND; Switch Function: On-On; Termination Style: SMD (SMT) Tab

## Sheet Lighting.SchDoc: Exterior LED Lighting
size A4; DrawnBy: Samyar Sadat Akhavi; Revision: 1.0; SheetNumber: 11; SheetTotal: 13
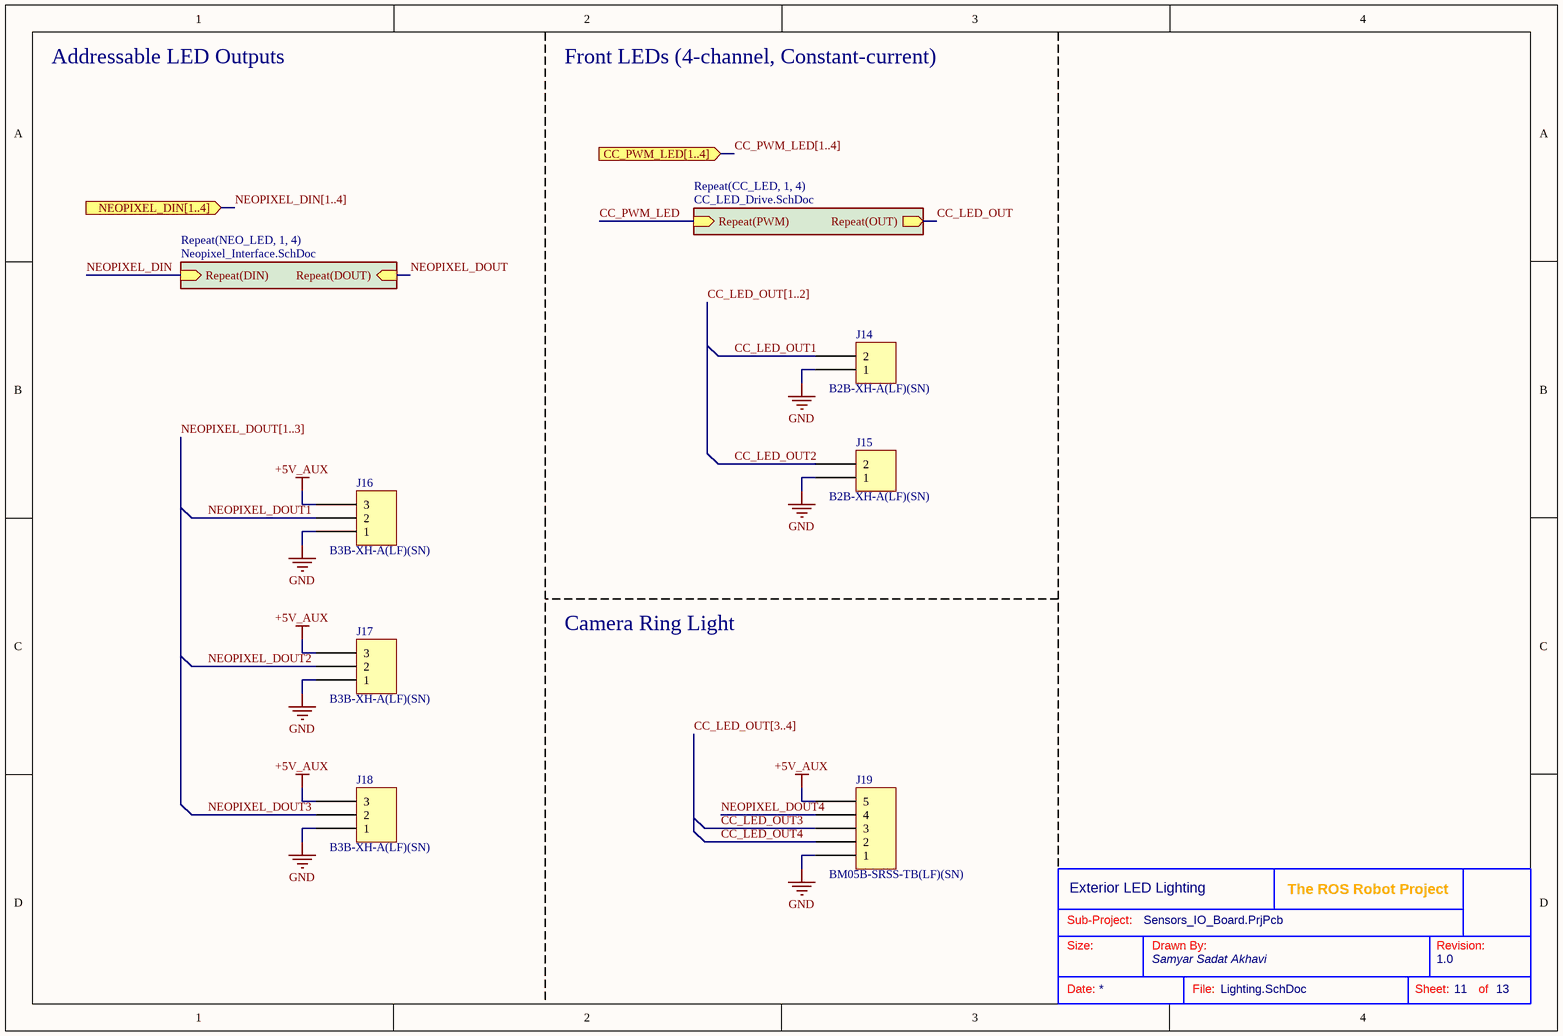
[diagram p4: Lighting.SchDoc]

### Parts
(Parts that share a designator on the sheet are numbered #1, #2 ... from top to bottom, then left to right.)
?#4  (no value)  (graphical)
J14  B2B-XH-A(LF)(SN)  [JST XH B2B-XH-A]
J15  B2B-XH-A(LF)(SN)  [JST XH B2B-XH-A]
J16  B3B-XH-A(LF)(SN)  [JST XH B3B-XH-A]
J17  B3B-XH-A(LF)(SN)  [JST XH B3B-XH-A]
J18  B3B-XH-A(LF)(SN)  [JST XH B3B-XH-A]
J19  BM05B-SRSS-TB(LF)(SN)  [JST BM05B-SRSS-TB]

### Sub-sheets
Repeat(CC_LED, 1, 4) = CC_LED_Drive.SchDoc (file not in this document): Repeat(PWM) (in), Repeat(OUT) (out)
Repeat(NEO_LED, 1, 4) = Neopixel_Interface.SchDoc: Repeat(DIN) (in), Repeat(DOUT) (in)

### Ports
CC_PWM_LED[1..4] (in, see Sensors_IO_Board[3B], Microcontroller[3C]), NEOPIXEL_DIN[1..4] (in, see Sensors_IO_Board[3B])

### Nets
+5V_AUX: J16.3 J17.3 J18.3 J19.5
GND: J14.1 J15.1 J16.1 J17.1 J18.1 J19.1
CC_LED_OUT: sheet Repeat(CC_LED, 1, 4)/Repeat(OUT)
CC_LED_OUT1: J14.2
CC_LED_OUT2: J15.2
CC_LED_OUT3: J19.3
CC_LED_OUT4: J19.2
CC_PWM_LED: sheet Repeat(CC_LED, 1, 4)/Repeat(PWM)
NEOPIXEL_DIN: sheet Repeat(NEO_LED, 1, 4)/Repeat(DIN)
NEOPIXEL_DOUT: sheet Repeat(NEO_LED, 1, 4)/Repeat(DOUT)
NEOPIXEL_DOUT1: J16.2
NEOPIXEL_DOUT2: J17.2
NEOPIXEL_DOUT3: J18.2
NEOPIXEL_DOUT4: J19.4

### Buses and harness runs
bus CC_LED_OUT[1..2]
bus CC_LED_OUT[3..4]
bus CC_PWM_LED[1..4] = port CC_PWM_LED[1..4]
bus NEOPIXEL_DIN[1..4] = port NEOPIXEL_DIN[1..4]
bus NEOPIXEL_DOUT[1..3]

### Notes on the sheet
- Addressable LED Outputs
- Front LEDs (4-channel, Constant-current)
- Camera Ring Light
- Sub-Project:
- Size:
- Drawn By:
- Revision:
- Date:
- File:
- Sheet:
- of

### Library data of the parts
?#4 = Standard Title Block
J14 J15 = B2B-XH-A(LF)(SN): CONN HEADER VERT 2POS 2.5MM; Manufacturer: JST Sales America Inc.; Contact Length - Post: 0.134" (3.40mm); Current Rating (Amps): 3A; Material Flammability Rating: UL94 V-0; Number of Positions: 2; Number of Positions Loaded: All; Pitch - Mating: 0.098" (2.50mm); Shrouding: Shrouded - 4 Wall; Style: Board to Cable/Wire; Voltage Rating: 250V; Part Number: B2B-XH-A(LF)(SN); ComponentLink1Description: Datasheet; ComponentLink1URL: http://www.jst-mfg.com/product/pdf/eng/eXH.pdf; ComponentLink2Description: DigiKey Link; ComponentLink2URL: http://digikey.com/product-detail/en/jst-sales-america-inc/B2B-XH-A-LF-SN/455-2247-ND/1651045; Connector Type: Header; Contact Finish - Mating: Tin; Contact Finish - Post: Tin; Contact Material: Brass; Contact Shape: Square; Contact Type: Male Pin; Fastening Type: Detent Lock; Insulation Color: Natural; Insulation Height: 0.276" (7.00mm); Insulation Material: Polyamide (PA66), Nylon 6/6; LastUpdated: 1/12/2020 11:46:08 PM; Lifecycle Status: Active; Minimum Order: 1; Mounting Type: Through Hole; Number of Rows: 1; Operating Temperature: -25°C ~ 85°C; Packaging: Bulk; PartId: 67; Part Status: Active; Price: 0.15; Series: XH; Supplier 1: DigiKey; Supplier Part Number 1: 455-2247-ND; Termination: Press-Fit, Solder
J16-J18 = B3B-XH-A(LF)(SN): CONN HEADER VERT 3POS 2.5MM; Manufacturer: JST Sales America Inc.; Contact Length - Post: 0.134" (3.40mm); Current Rating (Amps): 3A; Material Flammability Rating: UL94 V-0; Number of Positions: 3; Number of Positions Loaded: All; Pitch - Mating: 0.098" (2.50mm); Shrouding: Shrouded - 4 Wall; Style: Board to Cable/Wire; Voltage Rating: 250V; Part Number: B3B-XH-A(LF)(SN); ComponentLink1Description: Datasheet; ComponentLink1URL: http://www.jst-mfg.com/product/pdf/eng/eXH.pdf; ComponentLink2Description: DigiKey Link; ComponentLink2URL: http://digikey.com/product-detail/en/jst-sales-america-inc/B3B-XH-A-LF-SN/455-2248-ND/1651046; Connector Type: Header; Contact Finish - Mating: Tin; Contact Finish - Post: Tin; Contact Material: Brass; Contact Shape: Square; Contact Type: Male Pin; Fastening Type: Detent Lock; Insulation Color: Natural; Insulation Height: 0.276" (7.00mm); Insulation Material: Polyamide (PA66), Nylon 6/6; LastUpdated: 1/12/2020 11:46:22 PM; Lifecycle Status: Active; Minimum Order: 1; Mounting Type: Through Hole; Number of Rows: 1; Operating Temperature: -25°C ~ 85°C; Packaging: Bulk; PartId: 68; Part Status: Active; Price: 0.19; Series: XH; Supplier 1: DigiKey; Supplier Part Number 1: 455-2248-ND; Termination: Press-Fit, Solder
J19 = BM05B-SRSS-TB(LF)(SN): CONN HEADER SMD 5POS 1MM; Manufacturer: JST Sales America Inc.; Current Rating (Amps): 0.7A; Material Flammability Rating: UL94 V-0; Number of Positions: 5; Number of Positions Loaded: All; Pitch - Mating: 0.039" (1.00mm); Shrouding: Shrouded - 4 Wall; Style: Board to Cable/Wire; Voltage Rating: 50V; Part Number: BM05B-SRSS-TB(LF)(SN); ComponentLink1Description: Datasheet; ComponentLink1URL: http://www.jst-mfg.com/product/pdf/eng/eSR.pdf; ComponentLink2Description: DigiKey Link; ComponentLink2URL: http://digikey.com/product-detail/en/jst-sales-america-inc/BM05B-SRSS-TB-LF-SN/455-1791-1-ND/926862; Connector Type: Header; Contact Finish - Mating: Tin; Contact Finish - Post: Tin; Contact Material: Copper Alloy; Contact Shape: Square; Contact Type: Male Pin; Fastening Type: Push-Pull; Features: Solder Retention; Insulation Color: Natural; Insulation Height: 0.167" (4.25mm); Insulation Material: Polyamide (PA), Nylon; LastUpdated: 1/12/2020 10:14:00 PM; Lifecycle Status: Active; Minimum Order: 1; Mounting Type: Surface Mount; Number of Rows: 1; Operating Temperature: -25°C ~ 85°C; Packaging: TapeAndReel; PartId: 18; Part Status: Active; Price: 0.35; Series: SR; Supplier 1: DigiKey; Supplier Part Number 1: 455-1791-1-ND; Termination: Solder

## Sheet Neopixel_Interface.SchDoc: Neopixel LED Interface
size A4; DrawnBy: Samyar Sadat Akhavi; Revision: 1.0; SheetNumber: 12; SheetTotal: 14
Used 4 times, as channels LIGHTING/NEO_LED1, LIGHTING/NEO_LED2, LIGHTING/NEO_LED3, LIGHTING/NEO_LED4. Parts and nets are listed once, with the designators drawn on the sheet.
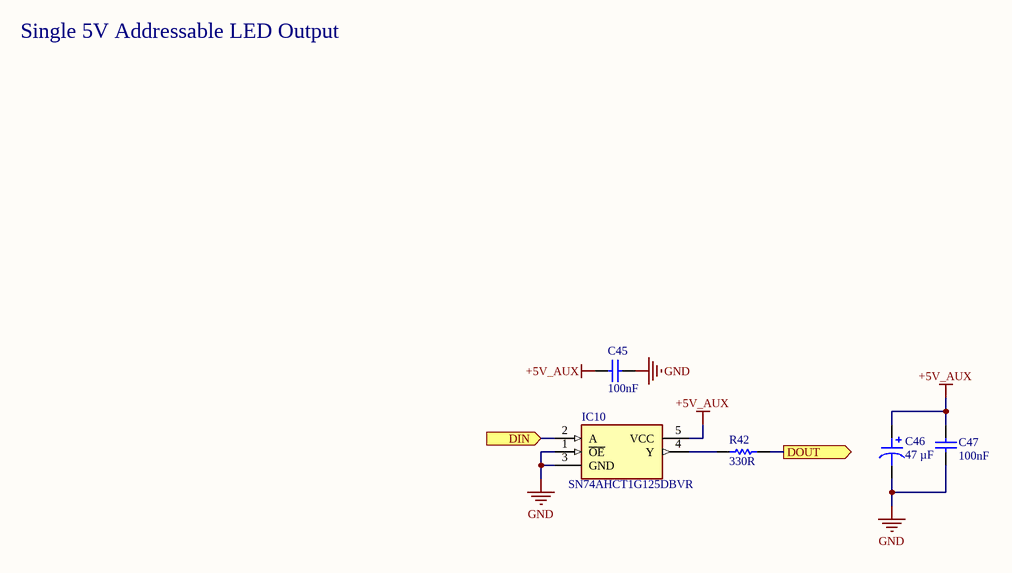
[diagram p5: Neopixel_Interface.SchDoc]

### Parts
?  (no value)  (graphical)
C45  100nF  [CAP_SMD_603]
C46  47 µF  [CAP ALSMD 6.6MM H5.4MM]
C47  100nF  [CAP_SMD_603]
IC10  SN74AHCT1G125DBVR  [SOT95P280X145-5N]
R42  330R  [RES_0603]

### Ports
DIN (in, see Lighting[1B]), DOUT (out, see Lighting[2B])

### Nets
+5V_AUX: C45.2 C46.1 C47.2 IC10.5(VCC)
GND: C45.1 C46.2 C47.1 IC10.1(~{OE}) IC10.3(GND)
DIN: IC10.2(A) ; port DIN
DOUT: R42.1 ; port DOUT
NetIC10_4: IC10.4(Y) R42.2

### Channels
LIGHTING/NEO_LED1: designators end in _NEO_LED1; ports DIN=NEOPIXEL_DIN1 DOUT=NEOPIXEL_DOUT1
LIGHTING/NEO_LED2: designators end in _NEO_LED2; ports DIN=NEOPIXEL_DIN2 DOUT=NEOPIXEL_DOUT2
LIGHTING/NEO_LED3: designators end in _NEO_LED3; ports DIN=NEOPIXEL_DIN3 DOUT=NEOPIXEL_DOUT3
LIGHTING/NEO_LED4: designators end in _NEO_LED4; ports DIN=NEOPIXEL_DIN4 DOUT=NEOPIXEL_DOUT4

### Notes on the sheet
- Single 5V Addressable LED Output
- Sub-Project:
- Size:
- Drawn By:
- Revision:
- Date:
- File:
- Sheet:
- of

### Library data of the parts
? = Standard Title Block
C45 C47 = Non-polar Capacitor: Generic Ceramic Capacitor; Voltage: 6.3V; Value: 100nF
C46 = 865080443007: as C44 on sheet Fan_Drive; Part Number: 865080443007; Applications: General Purpose; Capacitance: 47 µF; componentlink1description: Datasheet; componentlink1url: https://katalog.we-online.de/pbs/datasheet/865080443007.pdf; componentlink2description: DigiKey Link; componentlink2url: https://www.digikey.com/en/products/detail/würth-elektronik/865080443007/5728030; Device Package: Radial, Can - SMD; Height - Seated (Max): 0.217" (5.50mm); lastupdated: 6/3/2024 7:53:40 PM; Lifecycle Status: Active; Minimum Order: 1; Mounting Type: Surface Mount; Operating Temperature: -55°C ~ 105°C; Package / Case: Radial, Can - SMD; packaging: TapeAndReel; partid: 8980; Part Status: Active; price: 0.15; series: WCAP-ASLI; Size / Dimension: 0.248" Dia (6.30mm); Supplier 1: DigiKey; Supplier Part Number 1: 732-8435-1-ND; Tolerance: ±20%; value: 47 µF; Voltage - Rated: 25 V
IC10 = SN74AHCT1G125DBVR: Integrated Circuit; Manufacturer_Name: Texas Instruments; Datasheet Link: http://www.ti.com/lit/ds/symlink/sn74ahct1g125.pdf; Height: 1.45mm; Manufacturer_Part_Number: SN74AHCT1G125DBVR; Mouser Part Number: 595-SNAHCT1G125DBVR; Mouser Price/Stock: https://www.mouser.co.uk/ProductDetail/Texas-Instruments/SN74AHCT1G125DBVR?qs=N6WZOzgtpqVaVW8Lh%252BgevA%3D%3D; Arrow Part Number: SN74AHCT1G125DBVR; Arrow Price/Stock: https://www.arrow.com/en/products/sn74ahct1g125dbvr/texas-instruments?utm_currency=USD&region=nac
R42 = Resistor: Power: 1/8W; Value: 330R

## Sheet Ultrasonic_Interface.SchDoc: 5V Ultrasonic Interface
size A4; DrawnBy: Samyar Sadat Akhavi; Revision: 1.0; SheetNumber: 6; SheetTotal: 14
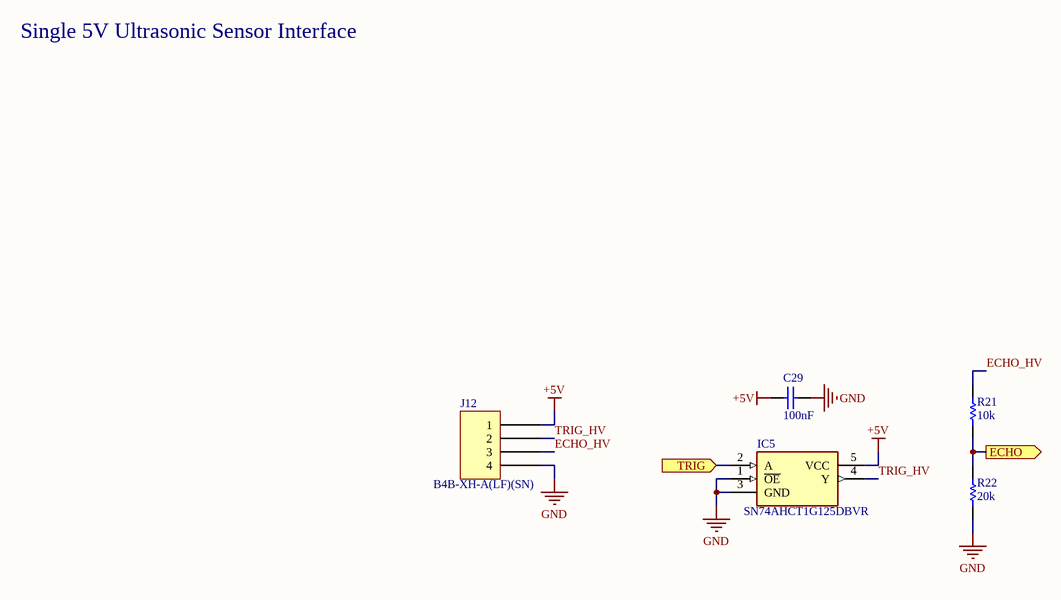
[diagram p6: Ultrasonic_Interface.SchDoc]

### Parts
(Parts that share a designator on the sheet are numbered #1, #2 ... from top to bottom, then left to right.)
?#5  (no value)  (graphical)
C29  100nF  [CAP_SMD_603]
IC5  SN74AHCT1G125DBVR  [SOT95P280X145-5N]
J12  B4B-XH-A(LF)(SN)  [JST XH B4B-XH-A]
R21  10k  [RES_0603]
R22  20k  [RES_0603]

### Ports
ECHO (out, see Sensors_IO[3A]), TRIG (in, see Sensors_IO[3A])

### Nets
+5V: C29.2 IC5.5(VCC) J12.1
GND: C29.1 IC5.1(~{OE}) IC5.3(GND) J12.4 R22.2
ECHO_HV: J12.3 R21.1
TRIG_HV: IC5.4(Y) J12.2
NetIC5_2: IC5.2(A) ; port TRIG
NetR21_2: R21.2 R22.1 ; port ECHO

### Notes on the sheet
- Single 5V Ultrasonic Sensor Interface
- Sub-Project:
- Size:
- Drawn By:
- Revision:
- Date:
- File:
- Sheet:
- of

### Library data of the parts
?#5 = Standard Title Block
C29 = Non-polar Capacitor: Generic Ceramic Capacitor; Voltage: 6.3V; Value: 100nF
IC5 = SN74AHCT1G125DBVR: as IC10 on sheet Neopixel_Interface; Datasheet Link: http://www.ti.com/lit/ds/symlink/sn74ahct1g125.pdf; Height: 1.45mm; Manufacturer_Part_Number: SN74AHCT1G125DBVR; Mouser Part Number: 595-SNAHCT1G125DBVR; Mouser Price/Stock: https://www.mouser.co.uk/ProductDetail/Texas-Instruments/SN74AHCT1G125DBVR?qs=N6WZOzgtpqVaVW8Lh%252BgevA%3D%3D; Arrow Part Number: SN74AHCT1G125DBVR; Arrow Price/Stock: https://www.arrow.com/en/products/sn74ahct1g125dbvr/texas-instruments?utm_currency=USD&region=nac
J12 = B4B-XH-A(LF)(SN): CONN HEADER VERT 4POS 2.5MM; Manufacturer: JST Sales America Inc.; Contact Length - Post: 0.134" (3.40mm); Current Rating (Amps): 3A; Material Flammability Rating: UL94 V-0; Number of Positions: 4; Number of Positions Loaded: All; Pitch - Mating: 0.098" (2.50mm); Shrouding: Shrouded - 4 Wall; Style: Board to Cable/Wire; Voltage Rating: 250V; Part Number: B4B-XH-A(LF)(SN); ComponentLink1Description: Datasheet; ComponentLink1URL: http://www.jst-mfg.com/product/pdf/eng/eXH.pdf; ComponentLink2Description: DigiKey Link; ComponentLink2URL: http://digikey.com/product-detail/en/jst-sales-america-inc/B4B-XH-A-LF-SN/455-2249-ND/1651047; Connector Type: Header; Contact Finish - Mating: Tin; Contact Finish - Post: Tin; Contact Material: Brass; Contact Shape: Square; Contact Type: Male Pin; Fastening Type: Detent Lock; Insulation Color: Natural; Insulation Height: 0.276" (7.00mm); Insulation Material: Polyamide (PA66), Nylon 6/6; LastUpdated: 1/12/2020 11:46:34 PM; Lifecycle Status: Active; Minimum Order: 1; Mounting Type: Through Hole; Number of Rows: 1; Operating Temperature: -25°C ~ 85°C; Packaging: Bulk; PartId: 69; Part Status: Active; Price: 0.21; Series: XH; Supplier 1: DigiKey; Supplier Part Number 1: 455-2249-ND; Termination: Press-Fit, Solder
R21 R22 = Resistor: Power: 1/8W
  R21: Value: 10k
  R22: Value: 20k

## Nets that join several sheets
+3V3: Microcontroller (31 pins), Thermal (7 pins), THERM_CTRL/FAN1 (R38_FAN1.2 R40_FAN1.1), THERM_CTRL/FAN2 (R38_FAN2.2 R40_FAN2.1), THERM_CTRL/FAN3 (R38_FAN3.2 R40_FAN3.1)
+5V_AUX: Lighting (J16.3 J17.3 J18.3 J19.5), LIGHTING/NEO_LED1 (C45_NEO_LED1.2 C46_NEO_LED1.1 C47_NEO_LED1.2 IC10_NEO_LED1.5), LIGHTING/NEO_LED2 (C45_NEO_LED2.2 C46_NEO_LED2.1 C47_NEO_LED2.2 IC10_NEO_LED2.5), LIGHTING/NEO_LED3 (C45_NEO_LED3.2 C46_NEO_LED3.1 C47_NEO_LED3.2 IC10_NEO_LED3.5), LIGHTING/NEO_LED4 (C45_NEO_LED4.2 C46_NEO_LED4.1 C47_NEO_LED4.2 IC10_NEO_LED4.5)
GND: Sensors_IO_Board (D1.2 D2.2), Microcontroller (28 pins), Thermal (5 pins), THERM_CTRL/FAN1 (7 pins), THERM_CTRL/FAN2 (7 pins), THERM_CTRL/FAN3 (7 pins), Lighting (6 pins), LIGHTING/NEO_LED1 (5 pins), LIGHTING/NEO_LED2 (5 pins), LIGHTING/NEO_LED3 (5 pins), LIGHTING/NEO_LED4 (5 pins), Ultrasonic_Interface (5 pins)
VBAT_AUX: THERM_CTRL/FAN1 (C42_FAN1.1 C43_FAN1.2 IC8_FAN1.2 IC9_FAN1.2), THERM_CTRL/FAN2 (C42_FAN2.1 C43_FAN2.2 IC8_FAN2.2 IC9_FAN2.2), THERM_CTRL/FAN3 (C42_FAN3.1 C43_FAN3.2 IC8_FAN3.2 IC9_FAN3.2)
FLT_LED: Sensors_IO_Board (R2.2), Microcontroller (IC1.80)
NEOPIXEL_DIN1: Microcontroller (IC1.7), LIGHTING/NEO_LED1 (IC10_NEO_LED1.2)
NEOPIXEL_DIN2: Microcontroller (IC1.8), LIGHTING/NEO_LED2 (IC10_NEO_LED2.2)
NEOPIXEL_DIN3: Microcontroller (IC1.9), LIGHTING/NEO_LED3 (IC10_NEO_LED3.2)
NEOPIXEL_DIN4: Microcontroller (IC1.11), LIGHTING/NEO_LED4 (IC10_NEO_LED4.2)
NEOPIXEL_DOUT1: Lighting (J16.2), LIGHTING/NEO_LED1 (R42_NEO_LED1.1)
NEOPIXEL_DOUT2: Lighting (J17.2), LIGHTING/NEO_LED2 (R42_NEO_LED2.1)
NEOPIXEL_DOUT3: Lighting (J18.2), LIGHTING/NEO_LED3 (R42_NEO_LED3.1)
NEOPIXEL_DOUT4: Lighting (J19.4), LIGHTING/NEO_LED4 (R42_NEO_LED4.1)
PWM_FAN1: Thermal (IC4.5), THERM_CTRL/FAN1 (S3_FAN1.2)
PWM_FAN2: Thermal (IC4.7), THERM_CTRL/FAN2 (S3_FAN2.2)
PWM_FAN3: Thermal (IC4.11), THERM_CTRL/FAN3 (S3_FAN3.2)
SYSOK_LED: Sensors_IO_Board (R1.2), Microcontroller (IC1.79)
TACH_FAN1: Thermal (IC4.6), THERM_CTRL/FAN1 (R41_FAN1.1)
TACH_FAN2: Thermal (IC4.8), THERM_CTRL/FAN2 (R41_FAN2.1)
TACH_FAN3: Thermal (IC4.12), THERM_CTRL/FAN3 (R41_FAN3.1)
TRML_ALERT: Microcontroller (IC1.58), Thermal (IC3.2 IC4.10 R20.2)